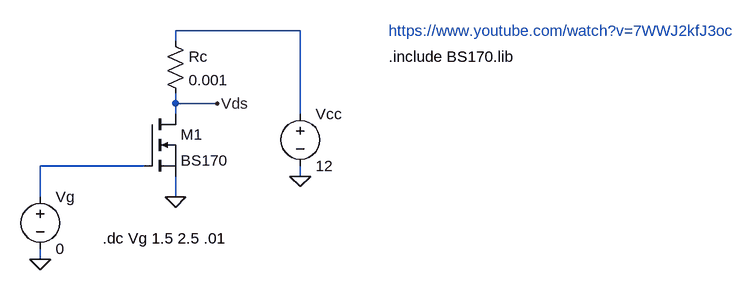
[diagram p0: schematic BS170 Input Characteristic Curve.asc]
BS170 Input Characteristic Curve.asc, the LTspice schematic file:
Version 4
SHEET 1 1232 680
WIRE 448 16 256 16
WIRE 256 32 256 16
WIRE 256 128 256 112
WIRE 320 128 256 128
WIRE 256 144 256 128
WIRE 448 144 448 16
WIRE 208 224 48 224
WIRE 448 240 448 224
WIRE 48 272 48 224
WIRE 256 272 256 240
WIRE 48 368 48 352
FLAG 256 272 0
FLAG 448 240 0
FLAG 48 368 0
FLAG 320 128 Vds
SYMBOL voltage 448 128 R0
WINDOW 123 0 0 Left 2
WINDOW 39 0 0 Left 2
SYMATTR InstName Vcc
SYMATTR Value 12
SYMBOL res 240 16 R0
SYMATTR InstName Rc
SYMATTR Value 0.001
SYMBOL voltage 48 256 R0
WINDOW 123 0 0 Left 2
WINDOW 39 0 0 Left 2
SYMATTR InstName Vg
SYMATTR Value 0
SYMBOL nmos 208 144 R0
SYMATTR InstName M1
SYMATTR Value BS170
SYMATTR Prefix X
TEXT 144 336 Left 2 !.dc Vg 1.5 2.5 .01
TEXT 584 16 Left 2 ;https://www.youtube.com/watch?v=7WWJ2kfJ3oc
TEXT 584 56 Left 2 !.include BS170.lib

The netlist it stands for:
* BS170 Input Characteristic Curve.asc
Vcc N001 0 12
Rc N001 Vds 0.001
Vg N002 0 0
XM1 Vds N002 0 BS170  ; pins D G S
.dc Vg 1.5 2.5 .01
* https://www.youtube.com/watch?v=7WWJ2kfJ3oc
.include BS170.lib
.backanno
.end